# Altium schematic sheet UART.SchDoc
size A4; SheetNumber: 6; SheetTotal: 11
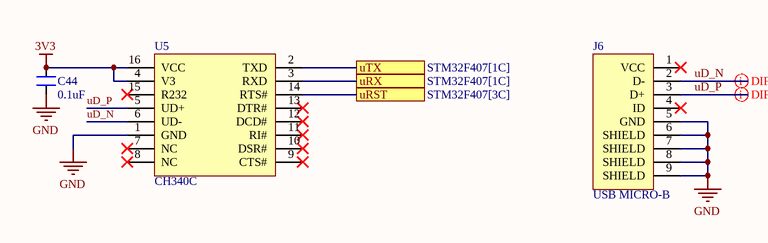
[diagram p0: UART.SchDoc]

## Parts
C44  0.1uF  [CAP_0805]
J6  USB MICRO-B  [CON_10118192-0001LF_SMD]
U5  CH340C  [SOIC16_50_284_25X90_SMT]

## Ports
uRST (see STM32F407[3C]), uRX (see STM32F407[1C]), uTX (see STM32F407[1C])

## Nets
3V3: C44.2 U5.4(V3) U5.16(VCC)
GND: C44.1 J6.5(GND) J6.6(SHIELD) J6.7(SHIELD) J6.8(SHIELD) J6.9(SHIELD) U5.1(GND)
uD_N: J6.2(D-) U5.6(UD-)
uD_P: J6.3(D+) U5.5(UD+)
uRST: U5.14(RTS#) ; port uRST
uRX: U5.3(RXD) ; port uRX
uTX: U5.2(TXD) ; port uTX

Not connected (* = marked no-connect by the designer): J6 1(VCC)* 4(ID)*; U5 7(NC)* 8(NC)* 9(CTS#)* 10(DSR#)* 11(RI#)* 12(DCD#)* 13(DTR#)* 15(R232)*

## Layout directives
differential pair; differential pair class *DIFF90: uD_N, uD_P

## Library data of the parts
C44 = CAP_0.1uF-50V-5%-0805: 0.1µF ±5% 50V Ceramic Capacitor X7R 0805 (2012 Metric); Manufacturer: AVX Corporation; Manufacturer Part Number: 08055C104JAT4A; Alternate Part Number-1: 0805B104M500; Case/Package: 0805; Supplier-1: SIRICOM; Supplier Part Number-1: 0805B104J500CT
J6 = CON_USB2.0_MICROB-SMD: USB - micro B USB 2.0 Receptacle Connector 5 Position Surface Mount, Right Angle; Manufacturer: ICC; Manufacturer Part Number: 10118192-0001LF; Alternate Part Number-1: NA; Case/Package: USB MICRO-B SMD; Supplier-1: SUNROM; Supplier Part Number-1: MICRO USB
U5 = IC_CH340C: USB Bridge, USB to UART USB 2.0 UART Interface; Manufacturer: Olimex; Alternate Part Number-1: NA; Manufacturer Part Number: CH340C; Case/Package: SOIC16; Supplier-1: LCSC; Supplier Part Number-1: C84681